# Altium schematic sheet S06.SchDoc: Quad Linear Amplifier
size 381 x 254 mm; Revision: 1.6; SheetNumber: 6; SheetTotal: 9
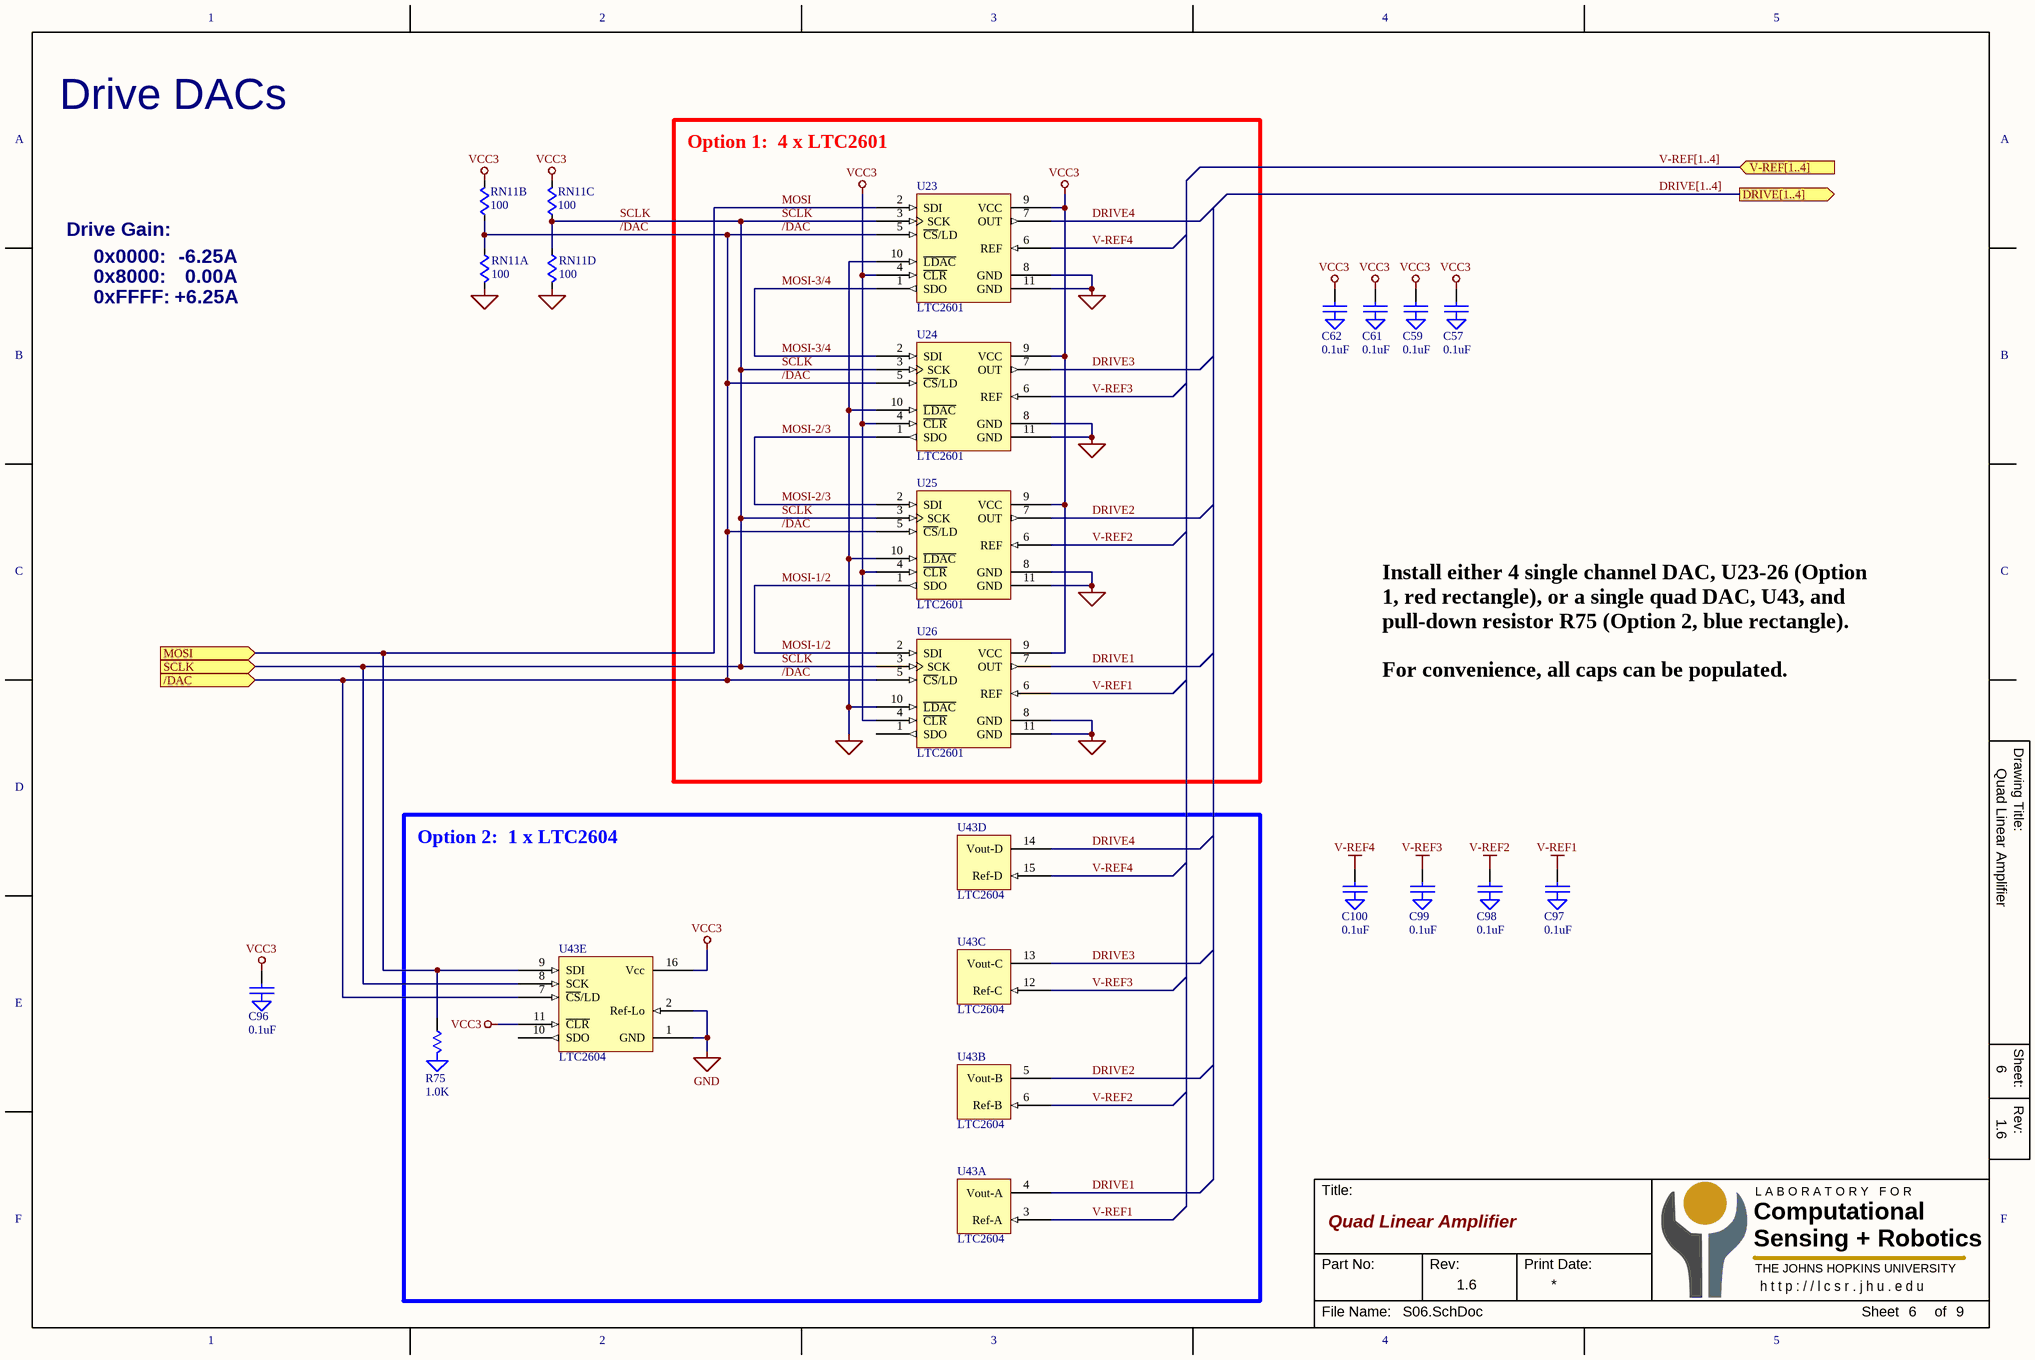
[diagram p0: S06.SchDoc]

## Parts
C57  0.1uF  [C0603]
C59  0.1uF  [C0603]
C61  0.1uF  [C0603]
C62  0.1uF  [C0603]
C96  0.1uF  [C0603]
C97  0.1uF  [C0603]
C98  0.1uF  [C0603]
C99  0.1uF  [C0603]
C100  0.1uF  [C0603]
R75  1.0K  [R0603]
RN11  100  [RN-742C083]  (parts A,B,C,D of 4)
U23  LTC2601  [DFN-10]
U24  LTC2601  [DFN-10]
U25  LTC2601  [DFN-10]
U26  LTC2601  [DFN-10]
U43  LTC2604  [QSOP-16]  (parts A,B,C,D,E of 5)

## Blocks framed on the sheet
Option 1:  4 x LTC2601: U23-U26
Option 2:  1 x LTC2604: R75 U43

## Ports
/DAC (in), DRIVE[1..4] (out), MOSI (in), SCLK (in), V-REF[1..4] (in)

## Nets
GND: C57.2(GND) C59.2(GND) C61.2(GND) C62.2(GND) C96.2(GND) C97.2(GND) C98.2(GND) C99.2(GND) C100.2(GND) R75.2(GND) RN11.5 RN11.8 U23.8(GND) U23.10(~{LDAC}) U23.11(GND) U24.8(GND) U24.10(~{LDAC}) U24.11(GND) U25.8(GND) U25.10(~{LDAC}) U25.11(GND) U26.8(GND) U26.10(~{LDAC}) U26.11(GND) U43.1(GND) U43.2(Ref-Lo)
V-REF1: C97.1 U26.6(REF) U43.3(Ref-A)
V-REF2: C98.1 U25.6(REF) U43.6(Ref-B)
V-REF3: C99.1 U24.6(REF) U43.12(Ref-C)
V-REF4: C100.1 U23.6(REF) U43.15(Ref-D)
VCC3: C57.1 C59.1 C61.1 C62.1 C96.1 RN11.6 RN11.7 U23.4(~{CLR}) U23.9(VCC) U24.4(~{CLR}) U24.9(VCC) U25.4(~{CLR}) U25.9(VCC) U26.4(~{CLR}) U26.9(VCC) U43.11(~{CLR}) U43.16(Vcc)
/DAC: RN11.1 RN11.2 U23.5(~{CS}/LD) U24.5(~{CS}/LD) U25.5(~{CS}/LD) U26.5(~{CS}/LD) U43.7(~{CS}/LD) ; port /DAC
DRIVE1: U26.7(OUT) U43.4(Vout-A)
DRIVE2: U25.7(OUT) U43.5(Vout-B)
DRIVE3: U24.7(OUT) U43.13(Vout-C)
DRIVE4: U23.7(OUT) U43.14(Vout-D)
MOSI: R75.1 U23.2(SDI) U43.9(SDI) ; port MOSI
MOSI-1/2: U25.1(SDO) U26.2(SDI)
MOSI-2/3: U24.1(SDO) U25.2(SDI)
MOSI-3/4: U23.1(SDO) U24.2(SDI)
SCLK: RN11.3 RN11.4 U23.3(SCK) U24.3(SCK) U25.3(SCK) U26.3(SCK) U43.8(SCK) ; port SCLK

Not connected (* = marked no-connect by the designer): U26 1(SDO); U43 10(SDO)

## Buses and harness runs
bus DRIVE[1..4] = port DRIVE[1..4]
bus V-REF[1..4] = port V-REF[1..4]

## Notes on the sheet
- Drive DACs
- Drive Gain:
- 0x0000:
- 0x8000:
- 0xFFFF:
- +6.25A
- -6.25A
- 0.00A
- Install either 4 single channel DAC, U23-26 (Option 1, red rectangle), or a single quad DAC, U43, and pull-down resistor R75 (Option 2, blue rectangle).
  For convenience, all caps can be populated.
- 1
- 2
- 3
- 4
- 5
- A
- B
- C
- Drawing Title:
- D
- E
- Sheet:
- Rev:
- F
- Title:
- Computational
- Sensing + Robotics
- L A B O R A T O R Y   F O R
- Part No:
- Print Date:
- THE JOHNS HOPKINS UNIVERSITY
- h t t p : / / l c s r . j h u . e d u
- File Name:
- Sheet
- of

## Library data of the parts
C57 C59 C61 C62 C96-C100 = CAP-GND
R75 = R-GND
RN11 = RN-DISC-SM-4X